# EAGLE design remote (EAGLE 7.6.0)
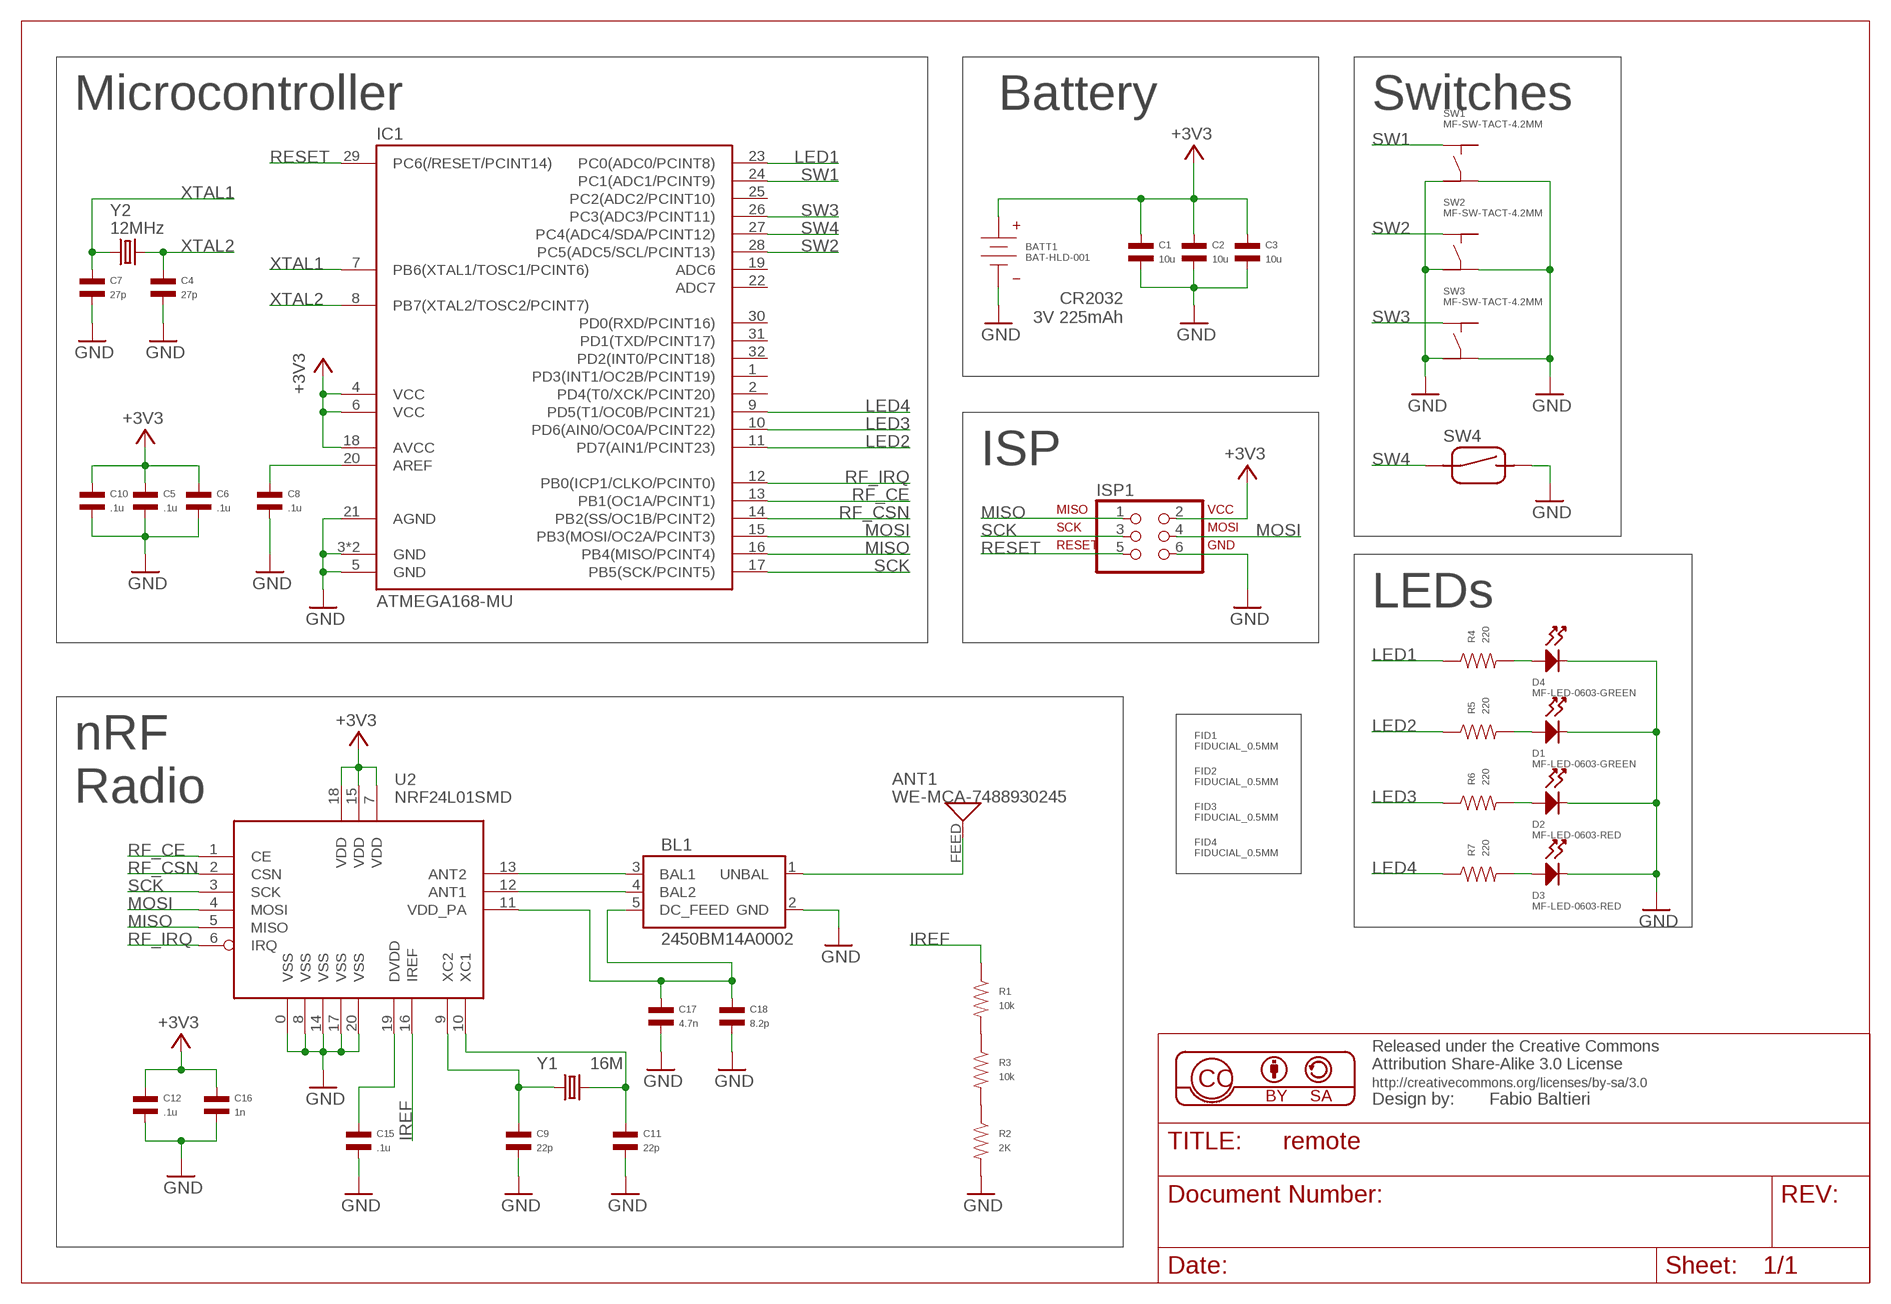
[diagram p0: schematic, sheet 1]

## Parts
ANT1  WE-MCA-7488930245  [WE-MCA]
BATT1  BAT-HLD-001  BATTERY_BAT-HLD-001  [BAT-HLD-001]
BL1  2450BM14A0002  [0603_BALUN]
C1  10u  CAPACITOR_NP_1206  [C1206]
C2  10u  CAPACITOR_NP_1206  [C1206]
C3  10u  CAPACITOR_NP_1206  [C1206]
C4  27p  CAPACITOR_NP_0402  [C0402]
C5  .1u  CAPACITOR_NP_0402  [C0402]
C6  .1u  CAPACITOR_NP_0402  [C0402]
C7  27p  CAPACITOR_NP_0402  [C0402]
C8  .1u  CAPACITOR_NP_0402  [C0402]
C9  22p  CAPACITOR_NP_0402  [C0402]
C10  .1u  CAPACITOR_NP_0402  [C0402]
C11  22p  CAPACITOR_NP_0402  [C0402]
C12  .1u  CAPACITOR_NP_0402  [C0402]
C15  .1u  CAPACITOR_NP_0402  [C0402]
C16  1n  CAPACITOR_NP_0402  [C0402]
C17  4.7n  CAPACITOR_NP_0402  [C0402]
C18  8.2p  CAPACITOR_NP_0402  [C0402]
D1  MF-LED-0603-GREEN  LED_SINGLE-0603-GREEN  [LED0603]
D2  MF-LED-0603-RED  LED_SINGLE-0603-RED  [LED0603]
D3  MF-LED-0603-RED  LED_SINGLE-0603-RED  [LED0603]
D4  MF-LED-0603-GREEN  LED_SINGLE-0603-GREEN  [LED0603]
FID1  FIDUCIAL_0.5MM  [FIDUCIAL_0.5MM]
FID2  FIDUCIAL_0.5MM  [FIDUCIAL_0.5MM]
FID3  FIDUCIAL_0.5MM  [FIDUCIAL_0.5MM]
FID4  FIDUCIAL_0.5MM  [FIDUCIAL_0.5MM]
IC1  ATMEGA168-MU  [MLF32-TH]
ISP1  ISP-AVR910PTH  [2X03]
R1  10k  RESISTOR_0402  [R0402]
R2  2K  RESISTOR_0402  [R0402]
R3  10k  RESISTOR_0402  [R0402]
R4  220  RESISTOR_0402  [R0402]
R5  220  RESISTOR_0402  [R0402]
R6  220  RESISTOR_0402  [R0402]
R7  220  RESISTOR_0402  [R0402]
SW1  MF-SW-TACT-4.2MM  TACT_4.2MM  [TACT4.2MM]
SW2  MF-SW-TACT-4.2MM  TACT_4.2MM  [TACT4.2MM]
SW3  MF-SW-TACT-4.2MM  TACT_4.2MM  [TACT4.2MM]
SW4  CT05-XXXX-J1  [CT05-XXXX-J1]
U2  NRF24L01SMD  [QFN20]
Y1  16M  CRYSTAL5X3  [CRYSTAL-SMD-5X3]
Y2  12MHz  CRYSTAL5X3  [CRYSTAL-SMD-5X3]

## Nets
+3V3: BATT1.POS_0(POS) BATT1.POS_1(POS) C1.P$1 C2.P$1 C3.P$1 C5.P$1 C6.P$1 C10.P$1 C12.P$1 C16.P$1 IC1.4(VCC) IC1.6(VCC) IC1.18(AVCC) ISP1.2 U2.7(VDD) U2.15(VDD) U2.18(VDD)
GND: BATT1.NEG_0(NEG) BL1.2(GND) C1.P$2 C2.P$2 C3.P$2 C4.P$2 C5.P$2 C6.P$2 C7.P$2 C8.P$2 C9.P$2 C10.P$2 C11.P$2 C12.P$2 C15.P$2 C16.P$2 C17.P$2 C18.P$2 D1.CATHODE D2.CATHODE D3.CATHODE D4.CATHODE IC1.3(GND) IC1.5(GND) IC1.21(AGND) IC1.TH(GND) ISP1.6 R2.P$2 SW1.P$3 SW1.P$4 SW2.P$3 SW2.P$4 SW3.P$3 SW3.P$4 SW4.P$2(B) U2.0(VSS) U2.8(VSS) U2.14(VSS) U2.17(VSS) U2.20(VSS)
IREF: R1.P$1 U2.16(IREF)
LED1: IC1.23(PC0(ADC0/PCINT8)) R4.P$1
LED2: IC1.11(PD7(AIN1/PCINT23)) R5.P$1
LED3: IC1.10(PD6(AIN0/OC0A/PCINT22)) R6.P$1
LED4: IC1.9(PD5(T1/OC0B/PCINT21)) R7.P$1
MISO: IC1.16(PB4(MISO/PCINT4)) ISP1.1 U2.5(MISO)
MOSI: IC1.15(PB3(MOSI/OC2A/PCINT3)) ISP1.4 U2.4(MOSI)
N$1: R2.P$1 R3.P$2
N$2: C8.P$1 IC1.20(AREF)
N$3: R1.P$2 R3.P$1
N$4: D3.ANODE R7.P$2
N$5: BL1.4(BAL2) U2.12(ANT1)
N$6: BL1.3(BAL1) U2.13(ANT2)
N$7: D2.ANODE R6.P$2
N$8: D1.ANODE R5.P$2
N$9: D4.ANODE R4.P$2
N$14: BL1.5(DC_FEED) C17.P$1 C18.P$1 U2.11(VDD_PA)
N$15: C15.P$1 U2.19(DVDD)
N$17: C11.P$1 U2.10(XC1) Y1.3
N$18: C9.P$1 U2.9(XC2) Y1.1
N$19: ANT1.FEED BL1.1(UNBAL)
RESET: IC1.29(PC6(/RESET/PCINT14)) ISP1.5
RF_CE: IC1.13(PB1(OC1A/PCINT1)) U2.1(CE)
RF_CSN: IC1.14(PB2(SS/OC1B/PCINT2)) U2.2(CSN)
RF_IRQ: IC1.12(PB0(ICP1/CLKO/PCINT0)) U2.6(IRQ)
SCK: IC1.17(PB5(SCK/PCINT5)) ISP1.3 U2.3(SCK)
SW1: IC1.24(PC1(ADC1/PCINT9)) SW1.P$1
SW2: IC1.28(PC5(ADC5/SCL/PCINT13)) SW2.P$1
SW3: IC1.26(PC3(ADC3/PCINT11)) SW3.P$1
SW4: IC1.27(PC4(ADC4/SDA/PCINT12)) SW4.P$1(A)
XTAL1: C7.P$1 IC1.7(PB6(XTAL1/TOSC1/PCINT6)) Y2.1
XTAL2: C4.P$1 IC1.8(PB7(XTAL2/TOSC2/PCINT7)) Y2.3
Unconnected: IC1.1(PD3(INT1/OC2B/PCINT19)) IC1.2(PD4(T0/XCK/PCINT20)) IC1.19(ADC6) IC1.22(ADC7) IC1.25(PC2(ADC2/PCINT10)) IC1.30(PD0(RXD/PCINT16)) IC1.31(PD1(TXD/PCINT17)) IC1.32(PD2(INT0/PCINT18)) SW1.P$2 SW2.P$2 SW3.P$2

## Notes on the sheet
- Microcontroller | Battery | Switches
- CR2032
  3V 225mAh
- ISP
- LEDs
- nRF
- Radio

## Library data of the parts
ANT1 = balto:WE-MCA: Wurth WE-MCA Multilayer Chip Antenna
BATT1 = MF_Connectors:BATTERY: Library: MF_Connectors Description: Batterys and Battery Connectors.; HOUSEPART: NO; MPN: BAT-HLD-001; POPULATE: 1; URL: http://www.mouser.com/ds/2/238/bat-hld-001-220194.pdf
BL1 = balto:2450BM14A0002: 2.45 GHz Impedance Matched Balun-Filter: Optimized for Nordic's Chipset nRF24L01, nRF24L01+, nRF24LE1, nRF24LU1, nRF24AP2, and nRF8001
C1-C3 = MF_Passives:CAPACITOR_NP: Library: MF_Passives Description: Device for Non-Polarized Capacitors. Manufacture part number (MPN) can be added via Attributes. Check https://factory.macrofab.com/parts for the house parts list.; MPN: MF-CAP-1206-10uF; POPULATE: 1
C4 C7 = MF_Passives:CAPACITOR_NP: Library: MF_Passives Description: Device for Non-Polarized Capacitors. Manufacture part number (MPN) can be added via Attributes. Check https://factory.macrofab.com/parts for the house parts list.; MPN: MF-CAP-0402-27p; POPULATE: 1
C5 C6 C8 C10 C12 C15 = MF_Passives:CAPACITOR_NP: Library: MF_Passives Description: Device for Non-Polarized Capacitors. Manufacture part number (MPN) can be added via Attributes. Check https://factory.macrofab.com/parts for the house parts list.; MPN: MF-CAP-0402-0.1uF; POPULATE: 1
C9 C11 = MF_Passives:CAPACITOR_NP: Library: MF_Passives Description: Device for Non-Polarized Capacitors. Manufacture part number (MPN) can be added via Attributes. Check https://factory.macrofab.com/parts for the house parts list.; MPN: MF-CAP-0402-22p; POPULATE: 1
C16 = MF_Passives:CAPACITOR_NP: Library: MF_Passives Description: Device for Non-Polarized Capacitors. Manufacture part number (MPN) can be added via Attributes. Check https://factory.macrofab.com/parts for the house parts list.; MPN: MF-CAP-0402-1nF; POPULATE: 1
C17 = MF_Passives:CAPACITOR_NP: Library: MF_Passives Description: Device for Non-Polarized Capacitors. Manufacture part number (MPN) can be added via Attributes. Check https://factory.macrofab.com/parts for the house parts list.; MPN: MF-CAP-0402-4.7nF; POPULATE: 1
C18 = MF_Passives:CAPACITOR_NP: Library: MF_Passives Description: Device for Non-Polarized Capacitors. Manufacture part number (MPN) can be added via Attributes. Check https://factory.macrofab.com/parts for the house parts list.; MPN: MF-CAP-0402-8.2pF; POPULATE: 1
D1 D4 = MF_LEDs:LED_SINGLE: Library: MF_LEDs Description: Device for Single LED Packages. Manufacture part number (MFG#) can be added via Attributes.; HOUSEPART: YES; MPN: MF-LED-0603-GREEN; POPULATE: 1; URL: https://factory.macrofab.com/part/MF-LED-0603-GREEN
D2 D3 = MF_LEDs:LED_SINGLE: Library: MF_LEDs Description: Device for Single LED Packages. Manufacture part number (MFG#) can be added via Attributes.; HOUSEPART: YES; MPN: MF-LED-0603-RED; POPULATE: 1; URL: https://factory.macrofab.com/part/MF-LED-0603-RED
FID1-FID4 = MF_Aesthetics:FIDUCIAL: Library: MF_Aesthetics Description: Fiducial marking for PCB alignment inside PNP and other machines.; HOUSEPART: NO; POPULATE: 0
IC1 = balto:ATMEGA168
ISP1 = balto:ISP-AVR910: PIN HEADER
R1 R3 = MF_Passives:RESISTOR: Library: MF_Passives Description: Device for Resistors. Manufacture part number (MPN), Voltage, Tolerance, and Wattage Rating can be added via Attributes. Check https://factory.macrofab.com/parts for the house parts list.; MPN: MF-RES-0402-10K; POPULATE: 1
R2 = MF_Passives:RESISTOR: Library: MF_Passives Description: Device for Resistors. Manufacture part number (MPN), Voltage, Tolerance, and Wattage Rating can be added via Attributes. Check https://factory.macrofab.com/parts for the house parts list.; MPN: MF-RES-0402-2K; POPULATE: 1
R4-R7 = MF_Passives:RESISTOR: Library: MF_Passives Description: Device for Resistors. Manufacture part number (MPN), Voltage, Tolerance, and Wattage Rating can be added via Attributes. Check https://factory.macrofab.com/parts for the house parts list.; MPN: MF-RES-0402-220; POPULATE: 1
SW1-SW3 = MF_Switches:TACT: Library: MF_Switches Description: Device for Tact Switches. Manufacture part number (MFG#) can be added via Attributes.; HOUSEPART: YES; MPN: MF-SW-TACT-4.2MM; POPULATE: 1; URL: https://factory.macrofab.com/part/MF-SW-TACT-4.2MM
SW4 = balto:CT05-XXXX-J1: CT05 Molded Reed Miniswitch J-lead https://media.digikey.com/pdf/Data%20Sheets/Coto%20Technology%20PDFS/CT05.pdf
U2 = SparkFun:NRF24L01: 2.4GHz Low Power Transceiver This is the very popular, low cost, very low power RF transceiver from Nordic Semiconductor. Simple SPI interface. SKU: COM-00690
Y1 = SparkFun:CRYSTAL: Crystals Various standard crystals. Proven footprints. Spark Fun Electronics SKU : COM-00534
Y2 = SparkFun-FreqCtrl:CRYSTAL: Various standard crystals. Proven footprints. Spark Fun Electronics SKU : COM-00534

## Board
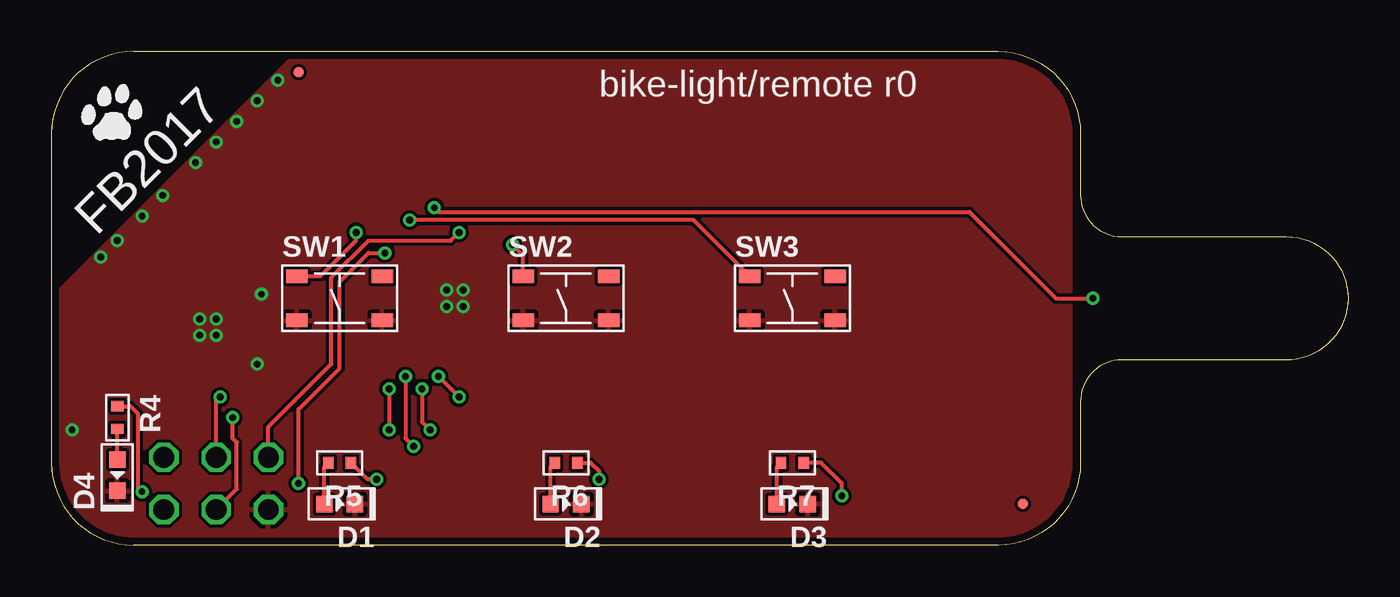
[diagram p1: board, top side]
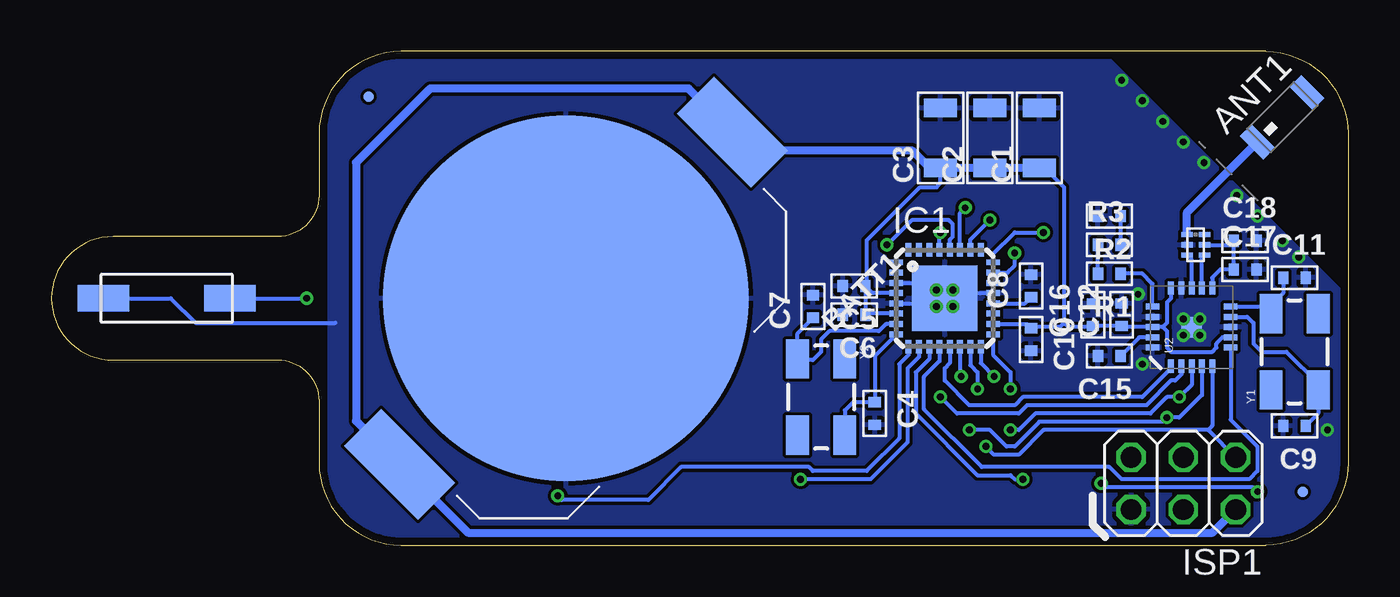
[diagram p2: board, bottom side, seen from below]

Size 63 x 24 mm. Coordinates in mm from the lower left corner, seen from the top.
Outline: 0,20 0,4 arc90 4,0 46,0 arc90 50,4 50,7 arc-90 52,9 60,9 arc90 63,12 arc90 60,15 52,15 arc-90 50,17 50,20 arc90 46,24 4,24 arc90 0,20
Copper layers (1*16): Top 0.035mm / dielectric 1.5mm / Bottom 0.035mm
Design rules "balto": minimum track width 6mil, minimum drill 13mil, track to track 6mil, track to pad 6mil, pad to pad 6mil, via to via 6mil, smd to smd 6mil, copper to edge 15mil, drill to drill 6mil, minimum pad ring 6mil, minimum via ring 6mil, stop-mask expansion 2mil, vias tented up to drill 20mil, thermal gap 8mil

### Footprints (pad centres in the part's own frame; a part is rotated, then mirrored left to right if it is on the bottom)
WE-MCA = smd 0.8 x 1.6: FEED -1.7,0; NC 1.7,0
BAT-HLD-001 = smd 17.78 x 17.78: NEG_0 0,0 | smd 2.54 x 5.08: POS_0 11.43,0; POS_1 -11.43,0
0603_BALUN = smd 0.25 x 0.55: 1 0.5,0.425; 2 0,0.425; 3 -0.5,0.425; 4 -0.5,-0.425; 5 0,-0.425; 6 0.5,-0.425
C1206 = smd 0.9 x 1.6: P$1 -1.45,0; P$2 1.45,0
C0402 = smd 0.5 x 0.6: P$1 -0.55,0; P$2 0.55,0
LED0603 = smd 0.8 x 0.8: ANODE 0.75,0; CATHODE -0.75,0
FIDUCIAL_0.5MM = smd 0.5 x 0.5: FID 0,0
MLF32-TH = smd 0.65 x 0.29: 1 -2.35,1.75; 2 -2.35,1.25; 3 -2.35,0.75; 4 -2.35,0.25; 5 -2.35,-0.25; 6 -2.35,-0.75; 7 -2.35,-1.25; 8 -2.35,-1.75; 17 2.35,-1.75; 18 2.35,-1.25; 19 2.35,-0.75; 20 2.35,-0.25; 21 2.35,0.25; 22 2.35,0.75; 23 2.35,1.25; 24 2.35,1.75 | smd 0.29 x 0.65: 9 -1.75,-2.35; 10 -1.25,-2.35; 11 -0.75,-2.35; 12 -0.25,-2.35; 13 0.25,-2.35; 14 0.75,-2.35; 15 1.25,-2.35; 16 1.75,-2.35; 25 1.75,2.35; 26 1.25,2.35; 27 0.75,2.35; 28 0.25,2.35; 29 -0.25,2.35; 30 -0.75,2.35; 31 -1.25,2.35; 32 -1.75,2.35 | smd 3.2 x 3.2: TH 0,0
2X03 = drill 1.016 octagon: 1 -2.54,-1.27; 2 -2.54,1.27; 3 0,-1.27; 4 0,1.27; 5 2.54,-1.27; 6 2.54,1.27
R0402 = smd 0.5 x 0.6: P$1 -0.55,0; P$2 0.55,0
TACT4.2MM = smd 1.05 x 0.65: P$1 -2.075,1.075; P$2 2.075,1.075; P$3 -2.075,-1.075; P$4 2.075,-1.075
CT05-XXXX-J1 = smd 2.5 x 1.3: P$1 -3.075,0; P$2 3.075,0
QFN20 = smd 1 x 1: 0 0,0 | smd 0.65 x 0.29: 1 -1.9,1; 2 -1.9,0.5; 3 -1.9,0; 4 -1.9,-0.5; 5 -1.9,-1; 11 1.9,-1; 12 1.9,-0.5; 13 1.9,0; 14 1.9,0.5; 15 1.9,1 | smd 0.29 x 0.65: 6 -1,-1.9; 7 -0.5,-1.9; 8 0,-1.9; 9 0.5,-1.9; 10 1,-1.9; 16 1,1.9; 17 0.5,1.9; 18 0,1.9; 19 -0.5,1.9; 20 -1,1.9
CRYSTAL-SMD-5X3 = smd 1.9 x 1.1: 1 -1.85,-1.15; 2 1.85,-1.15; 3 1.85,1.15; 4 -1.85,1.15

### Placement (x,y rotation side)
ANT1  3.2,20.8 45 bottom
BATT1  38,12 225 bottom
BL1  7.4,14.6 90 bottom
C1  15,19.8 90 bottom
C2  17.4,19.8 90 bottom
C3  19.8,19.8 90 bottom
C4  23,6.4 270 bottom
C5  24,12.6 180 bottom
C6  24,11.2 180 bottom
C7  26,11.6 90 bottom
C8  15.4,12.6 90 bottom
C9  2.6,5.8 180 bottom
C10  15.4,10 270 bottom
C11  2.6,13 0 bottom
C12  11,11.2 90 bottom
C15  11.6,9.2 180 bottom
C16  12.4,11.2 90 bottom
C17  5,13.4 0 bottom
C18  5,14.8 0 bottom
D1  14,2 180 top
D2  25,2 180 top
D3  36,2 180 top
D4  3.2,3.4 90 top
FID1  12,23 0 top
FID2  47.2,2 0 top
FID3  2.2,2.6 0 bottom
FID4  47.6,21.8 0 bottom
IC1  19.6,12 0 bottom
ISP1  8,3 180 bottom
R1  11.6,13.2 180 bottom
R2  11.6,16 180 bottom
R3  11.6,14.6 0 bottom
R4  3.2,6.2 270 top
R5  14,4 180 top
R6  25,4 180 top
R7  36,4 180 top
SW1  14,12 0 top
SW2  25,12 0 top
SW3  36,12 0 top
SW4  57.4,12 180 bottom
U2  7.6,10.6 90 bottom
U$1  [CAT-L]  3,20.6 0 top
Y1  2.6,9.4 90 bottom
Y2  25.6,7.2 270 bottom

### Tracks (layer width: path | path; a pad name or v marks a point on that pad's centre or on a via)
+3V3
  Bottom 0.2: U2.15 8.6,12 8.8,11.8 8.8,10.8 9,10.6 | 9,10.6 8.8,10.4 8.8,9.6 8.6,9.4 6.6,9.4 6.4,9.6 6.4,9.8 6.1,10.1 U2.7 | 9,10.6 U2.18 10.95,10.6 C12.P$1 C16.P$1 12.45,10.6 13.6,10.6 13.8,10.8 | IC1.6 23.4,11.25 C6.P$1 C5.P$1 | IC1.4 23.1,12.25 C5.P$1 | IC1.18 15.6,10.75 C10.P$1 | 15.3,10.65 C10.P$1 | C5.P$1 23.4,12.65 23.4,14.8 20.8,17.4 20,17.4 19.8,17.6 C3.P$1 | C1.P$1 14.75,18.35 13.8,17.4 13.8,10.8 | 13.8,10.8 14,10.6 15.35,10.6 C10.P$1
  Bottom 0.4: ISP1.2 6.59,0.6 42.76,0.6 BATT1.POS_0 48.2,6.04 48.2,18.6 44.6,22.2 32.04,22.2 BATT1.POS_1 29.04,19.2 21.2,19.2 20.35,18.35 C3.P$1 C2.P$1 C1.P$1
GND  (via drill 0.33)
  Bottom 0.2: IC1.TH 19.35,12.25 IC1.21 | IC1.5 20.85,11.75 20.6,12 20.6,12.4 20.95,12.75 IC1.3 | SW4.P$2 57.2,12 56,10.8 49.2,10.8
  other vias: 5.4,17 7,18.6 2.4,14 4.4,16 8,19.6 9,20.6 10,21.6 11,22.6 7.2,11 8,11 8,10.2 7.2,10.2 19.2,12.4 20,12.4 20,11.6 19.2,11.6 3.2,14.8 1,5.6 10,8.8 10.2,12.2
  pour Top: -1,-1 -1,11 13,25 49.5,25 49.5,-1
  pour Bottom: -2,-2 -2,10 14,26 49.5,26 49.5,-2
  pour Bottom (no thermals): 8.4,9.8 8.4,11.4 6.8,11.4 6.8,9.8
IREF
  Bottom 0.2: U2.16 9.5,12.7 10,13.2 R1.P$1
LED1  (via drill 0.33)
  Top 0.2: R4.P$1 3.85,6.75 4.2,6.4 4.2,2.8 v4.4,2.6 | v12,3 12,6.6 14,8.6 14,12.8 15.4,14.2 v16.2,14.2
  Bottom 0.2: v4.4,2.6 4.6,2.8 11.8,2.8 v12,3 | IC1.23 16.55,13.25 16.2,13.6 v16.2,14.2
LED2  (via drill 0.33)
  Top 0.2: v15.8,3.2 15.35,3.2 R5.P$1
  Bottom 0.2: IC1.11 20.35,9.05 21,8.4 21,6.4 18,3.4 16.4,3.4 16.2,3.2 v15.8,3.2
LED3  (via drill 0.33)
  Top 0.2: R6.P$1 26.2,4 26.6,3.6 v26.6,3.2
  Bottom 0.2: IC1.10 20.85,9.15 21.4,8.6 21.4,5 23.2,3.2 v26.6,3.2
LED4  (via drill 0.33)
  Top 0.2: v38.4,2.4 38.4,3 37.4,4 R7.P$1
  Bottom 0.2: IC1.9 21.35,9.25 21.8,8.8 21.8,5.2 23.4,3.6 26,3.6 26.2,3.8 32.4,3.8 34,2.2 38.2,2.2 v38.4,2.4
MISO  (via drill 0.33)
  Top 0.2: v17.2,8.2 17.2,5.2 v17.6,4.8
  Bottom 0.2: IC1.16 17.85,8.85 v17.2,8.2 | U2.5 6.6,5.8 6.8,5.6 | 6.8,5.6 14.8,5.6 16,4.4 17.2,4.4 v17.6,4.8 | 6.8,5.6 ISP1.1
MOSI  (via drill 0.33)
  Top 0.2: v18,7.6 18,6 v18.4,5.6 | ISP1.4 9,2.73 9,5 8.8,5.2 v8.8,6.2
  Bottom 0.2: IC1.15 18.35,8.75 18,8.4 v18,7.6 | v18.4,5.6 17.4,5.6 16.6,4.8 16.2,4.8 15,6 9,6 v8.8,6.2 8.2,6.2 7.1,7.3 U2.4
N$1
  Bottom 0.2: R3.P$2 R2.P$1
N$2
  Bottom 0.2: IC1.20 15.7,11.75 C8.P$1
N$3
  Bottom 0.2: R1.P$2 R3.P$1
N$4
  Top 0.2: D3.ANODE 35.25,3.8 R7.P$2
N$5
  Bottom 0.2: U2.12 7.1,13.97 BL1.4
N$6
  Bottom 0.2: U2.13 7.6,13.88 BL1.3
N$7
  Top 0.2: D2.ANODE 24.25,3.8 R6.P$2
N$8
  Top 0.2: D1.ANODE 13.25,3.8 R5.P$2
N$9
  Top 0.2: D4.ANODE R4.P$2
N$14
  Bottom 0.2: U2.11 6.6,13 6.2,13.4 C17.P$1 C18.P$1 5.75,14.6 BL1.5
N$15
  Bottom 0.2: U2.19 10.15,10.1 C15.P$1
N$17
  Bottom 0.2: U2.10 4.1,11.6 Y1.3 3.75,11.65 3.15,12.25 C11.P$1
N$18
  Bottom 0.2: U2.9 4.9,11.1 4.6,10.8 4.6,9.8 4.2,9.4 3,9.4 1.45,7.85 Y1.1 1.45,6.4 C9.P$1
N$19
  Bottom 0.2: BL1.1 7.83,15.18
  Bottom 0.4: 7.83,15.18 7.83,16.18 ANT1.FEED
RESET  (via drill 0.33)
  Top 0.2: ISP1.5 10.54,5.74 13.6,8.8 13.6,13 15.4,14.8 19.4,14.8 v19.8,15.2
  Bottom 0.2: IC1.29 19.85,15.15 v19.8,15.2
RF_CE
  Bottom 0.2: U2.1 8.6,8.6 10,7.2 15.8,7.2 16.2,6.8 18.4,6.8 19.6,8 19.6,8.6 19.35,8.85 IC1.13
RF_CSN  (via drill 0.33)
  Top 0.2: v19.8,7.2 v18.8,8.2
  Bottom 0.2: IC1.14 18.85,8.25 v18.8,8.2 | U2.2 8.1,8.3 8.4,8 8.6,8 9.8,6.8 15.6,6.8 16,6.4 19,6.4 v19.8,7.2
RF_IRQ
  Bottom 0.2: U2.6 5.7,6.1 4.4,4.8 4.4,3.6 4.8,3.2 11,3.2 11.6,3.8 17.8,3.8 20.6,6.6 20.6,8.2 19.85,8.95 IC1.12
SCK  (via drill 0.33)
  Top 0.2: v16.4,7.6 v16.4,5.6 | ISP1.3 8,7 v8.2,7.2
  Bottom 0.2: IC1.17 17.25,9.25 16.4,8.4 v16.4,7.6 | U2.3 7.6,7.8 v8.2,7.2 8.8,7.2 9.6,6.4 15.2,6.4 16,5.6 v16.4,5.6
SW1  (via drill 0.33)
  Top 0.2: SW1.P$1 13.07,13.07 14.8,14.8 v14.8,15.2
  Bottom 0.2: IC1.24 17.25,14.15 16.2,15.2 v14.8,15.2
SW2  (via drill 0.33)
  Top 0.2: SW2.P$1 22.93,14.07 v22.4,14.6
  Bottom 0.2: IC1.28 19.35,14.85 19.2,15 19.2,15.6 19.4,15.8 21.2,15.8 v22.4,14.6
SW3  (via drill 0.33)
  Top 0.2: SW3.P$1 31.2,15.8 v17.4,15.8
  Bottom 0.2: IC1.26 18.35,14.85 v17.4,15.8
SW4  (via drill 0.33)
  Top 0.2: v18.6,16.4 18.8,16.2 44.6,16.2 48.8,12 v50.6,12
  Bottom 0.2: SW4.P$1 v50.6,12 | IC1.27 18.85,16.15 v18.6,16.4
XTAL1
  Bottom 0.2: IC1.7 22.45,10.75 22.8,10.4 25.2,10.4 25.6,10 25.6,9.4 26,9 26.7,9 Y2.1 26.75,10.3 C7.P$1
XTAL2
  Bottom 0.2: IC1.8 23,9.2 C4.P$1 24.05,6.95 24.45,6.55 Y2.3

### Text on the board
_tsilk: bike-light/remote r0 | FB2017